# EAGLE schematic eg3301_pcb v3 (EAGLE 9.7.0)
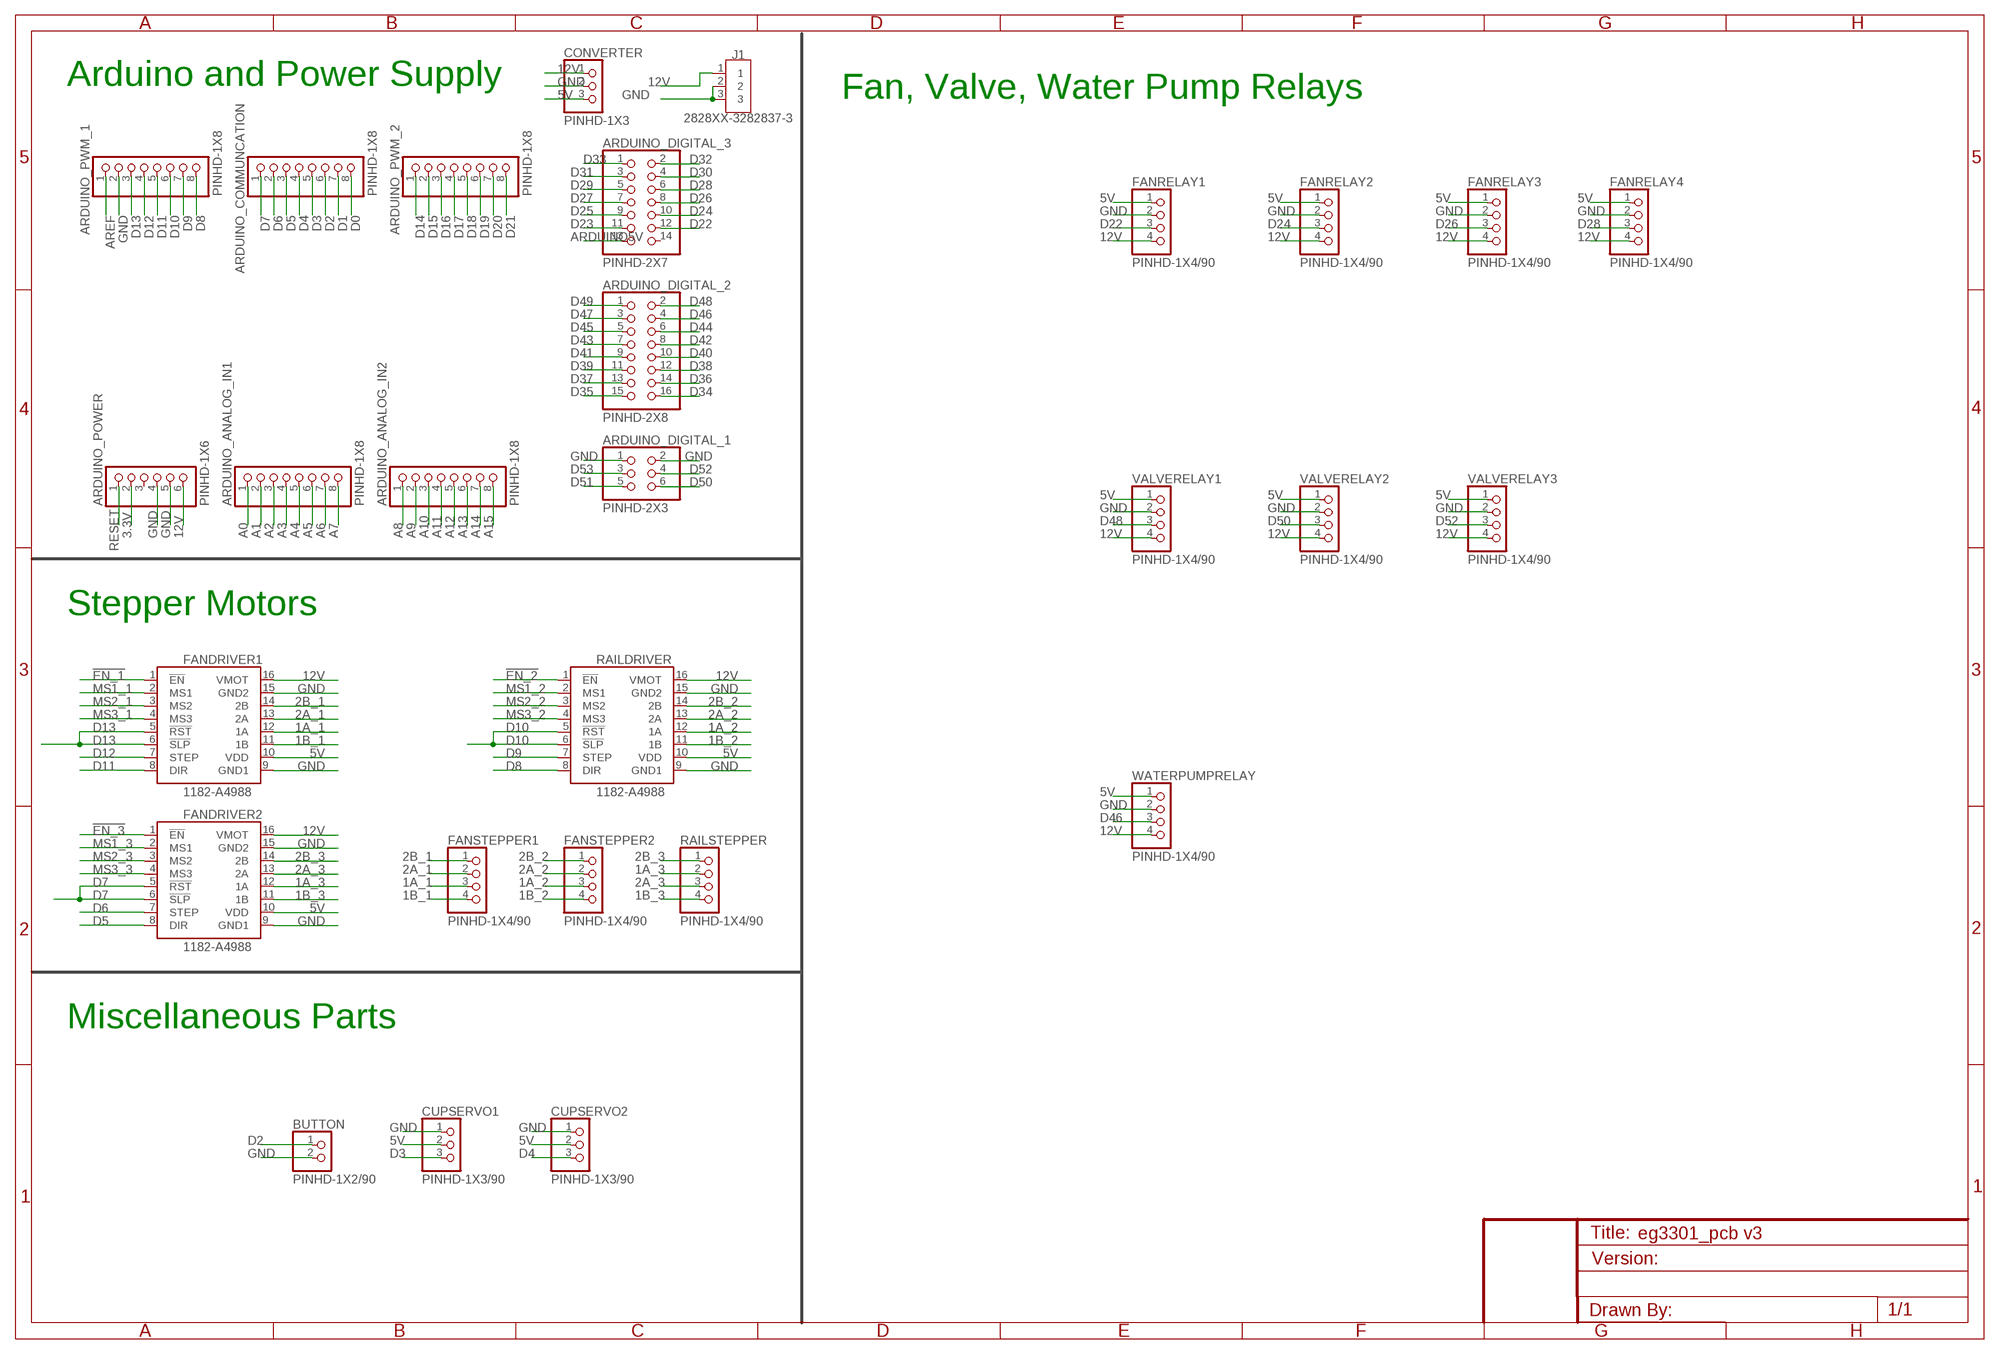
[diagram p0: schematic, sheet 1]

## Parts
ARDUINO_ANALOG_IN1  PINHD-1X8  [1X08]
ARDUINO_ANALOG_IN2  PINHD-1X8  [1X08]
ARDUINO_COMMUNCATION  PINHD-1X8  [1X08]
ARDUINO_DIGITAL_1  PINHD-2X3  [2X03]
ARDUINO_DIGITAL_2  PINHD-2X8  [2X08]
ARDUINO_DIGITAL_3  PINHD-2X7  [2X07]
ARDUINO_POWER  PINHD-1X6  [1X06]
ARDUINO_PWM_1  PINHD-1X8  [1X08]
ARDUINO_PWM_2  PINHD-1X8  [1X08]
BUTTON  PINHD-1X2/90  [1X02/90]
CONVERTER  PINHD-1X3  [1X03]
CUPSERVO1  PINHD-1X3/90  [1X03/90]
CUPSERVO2  PINHD-1X3/90  [1X03/90]
FANDRIVER1  1182-A4988  [A4988]
FANDRIVER2  1182-A4988  [A4988]
FANRELAY1  PINHD-1X4/90  [1X04/90]
FANRELAY2  PINHD-1X4/90  [1X04/90]
FANRELAY3  PINHD-1X4/90  [1X04/90]
FANRELAY4  PINHD-1X4/90  [1X04/90]
FANSTEPPER1  PINHD-1X4/90  [1X04/90]
FANSTEPPER2  PINHD-1X4/90  [1X04/90]
J1  2828XX-3282837-3  [TERMBLK_508-3N]
RAILDRIVER  1182-A4988  [A4988]
RAILSTEPPER  PINHD-1X4/90  [1X04/90]
VALVERELAY1  PINHD-1X4/90  [1X04/90]
VALVERELAY2  PINHD-1X4/90  [1X04/90]
VALVERELAY3  PINHD-1X4/90  [1X04/90]
WATERPUMPRELAY  PINHD-1X4/90  [1X04/90]

## Nets
1A_1: FANDRIVER1.12(1A) FANSTEPPER1.3
1A_2: FANSTEPPER2.3 RAILDRIVER.12(1A)
1A_3: FANDRIVER2.12(1A) RAILSTEPPER.2
1B_1: FANDRIVER1.11(1B) FANSTEPPER1.4
1B_2: FANSTEPPER2.4 RAILDRIVER.11(1B)
1B_3: FANDRIVER2.11(1B) RAILSTEPPER.4
2A_1: FANDRIVER1.13(2A) FANSTEPPER1.2
2A_2: FANSTEPPER2.2 RAILDRIVER.13(2A)
2A_3: FANDRIVER2.13(2A) RAILSTEPPER.3
2B_1: FANDRIVER1.14(2B) FANSTEPPER1.1
2B_2: FANSTEPPER2.1 RAILDRIVER.14(2B)
2B_3: FANDRIVER2.14(2B) RAILSTEPPER.1
3.3V: ARDUINO_POWER.2
5V: CONVERTER.3 CUPSERVO1.2 CUPSERVO2.2 FANDRIVER1.10(VDD) FANDRIVER2.10(VDD) FANRELAY1.1 FANRELAY2.1 FANRELAY3.1 FANRELAY4.1 RAILDRIVER.10(VDD) VALVERELAY1.1 VALVERELAY2.1 VALVERELAY3.1 WATERPUMPRELAY.1
12V: ARDUINO_POWER.6 CONVERTER.1 FANDRIVER1.16(VMOT) FANDRIVER2.16(VMOT) FANRELAY1.4 FANRELAY2.4 FANRELAY3.4 FANRELAY4.4 J1.1 RAILDRIVER.16(VMOT) VALVERELAY1.4 VALVERELAY2.4 VALVERELAY3.4 WATERPUMPRELAY.4
!EN_1: FANDRIVER1.1(!EN)
!EN_2: RAILDRIVER.1(!EN)
!EN_3: FANDRIVER2.1(!EN)
A0: ARDUINO_ANALOG_IN1.1
A1: ARDUINO_ANALOG_IN1.2
A2: ARDUINO_ANALOG_IN1.3
A3: ARDUINO_ANALOG_IN1.4
A4: ARDUINO_ANALOG_IN1.5
A5: ARDUINO_ANALOG_IN1.6
A6: ARDUINO_ANALOG_IN1.7
A7: ARDUINO_ANALOG_IN1.8
A8: ARDUINO_ANALOG_IN2.1
A9: ARDUINO_ANALOG_IN2.2
A10: ARDUINO_ANALOG_IN2.3
A11: ARDUINO_ANALOG_IN2.4
A12: ARDUINO_ANALOG_IN2.5
A13: ARDUINO_ANALOG_IN2.6
A14: ARDUINO_ANALOG_IN2.7
A15: ARDUINO_ANALOG_IN2.8
ARDUINO5V: ARDUINO_DIGITAL_3.13
AREF: ARDUINO_PWM_1.1
D0: ARDUINO_COMMUNCATION.8
D1: ARDUINO_COMMUNCATION.7
D2: ARDUINO_COMMUNCATION.6 BUTTON.1
D3: ARDUINO_COMMUNCATION.5 CUPSERVO1.3
D4: ARDUINO_COMMUNCATION.4 CUPSERVO2.3
D5: ARDUINO_COMMUNCATION.3 FANDRIVER2.8(DIR)
D6: ARDUINO_COMMUNCATION.2 FANDRIVER2.7(STEP)
D7: ARDUINO_COMMUNCATION.1 FANDRIVER2.5(!RST) FANDRIVER2.6(!SLP)
D8: ARDUINO_PWM_1.8 RAILDRIVER.8(DIR)
D9: ARDUINO_PWM_1.7 RAILDRIVER.7(STEP)
D10: ARDUINO_PWM_1.6 RAILDRIVER.5(!RST) RAILDRIVER.6(!SLP)
D11: ARDUINO_PWM_1.5 FANDRIVER1.8(DIR)
D12: ARDUINO_PWM_1.4 FANDRIVER1.7(STEP)
D13: ARDUINO_PWM_1.3 FANDRIVER1.5(!RST) FANDRIVER1.6(!SLP)
D14: ARDUINO_PWM_2.1
D15: ARDUINO_PWM_2.2
D16: ARDUINO_PWM_2.3
D17: ARDUINO_PWM_2.4
D18: ARDUINO_PWM_2.5
D19: ARDUINO_PWM_2.6
D20: ARDUINO_PWM_2.7
D21: ARDUINO_PWM_2.8
D22: ARDUINO_DIGITAL_3.12 FANRELAY1.3
D23: ARDUINO_DIGITAL_3.11
D24: ARDUINO_DIGITAL_3.10 FANRELAY2.3
D25: ARDUINO_DIGITAL_3.9
D26: ARDUINO_DIGITAL_3.8 FANRELAY3.3
D27: ARDUINO_DIGITAL_3.7
D28: ARDUINO_DIGITAL_3.6 FANRELAY4.3
D29: ARDUINO_DIGITAL_3.5
D30: ARDUINO_DIGITAL_3.4
D31: ARDUINO_DIGITAL_3.3
D32: ARDUINO_DIGITAL_3.2
D33: ARDUINO_DIGITAL_3.1
D34: ARDUINO_DIGITAL_2.16
D35: ARDUINO_DIGITAL_2.15
D36: ARDUINO_DIGITAL_2.14
D37: ARDUINO_DIGITAL_2.13
D38: ARDUINO_DIGITAL_2.12
D39: ARDUINO_DIGITAL_2.11
D40: ARDUINO_DIGITAL_2.10
D41: ARDUINO_DIGITAL_2.9
D42: ARDUINO_DIGITAL_2.8
D43: ARDUINO_DIGITAL_2.7
D44: ARDUINO_DIGITAL_2.6
D45: ARDUINO_DIGITAL_2.5
D46: ARDUINO_DIGITAL_2.4 WATERPUMPRELAY.3
D47: ARDUINO_DIGITAL_2.3
D48: ARDUINO_DIGITAL_2.2 VALVERELAY1.3
D49: ARDUINO_DIGITAL_2.1
D50: ARDUINO_DIGITAL_1.6 VALVERELAY2.3
D51: ARDUINO_DIGITAL_1.5
D52: ARDUINO_DIGITAL_1.4 VALVERELAY3.3
D53: ARDUINO_DIGITAL_1.3
GND: ARDUINO_DIGITAL_1.1 ARDUINO_DIGITAL_1.2 ARDUINO_POWER.4 ARDUINO_POWER.5 ARDUINO_PWM_1.2 BUTTON.2 CONVERTER.2 CUPSERVO1.1 CUPSERVO2.1 FANDRIVER1.9(GND1) FANDRIVER1.15(GND2) FANDRIVER2.9(GND1) FANDRIVER2.15(GND2) FANRELAY1.2 FANRELAY2.2 FANRELAY3.2 FANRELAY4.2 J1.2 J1.3 RAILDRIVER.9(GND1) RAILDRIVER.15(GND2) VALVERELAY1.2 VALVERELAY2.2 VALVERELAY3.2 WATERPUMPRELAY.2
MS1_1: FANDRIVER1.2(MS1)
MS1_2: RAILDRIVER.2(MS1)
MS1_3: FANDRIVER2.2(MS1)
MS2_1: FANDRIVER1.3(MS2)
MS2_2: RAILDRIVER.3(MS2)
MS2_3: FANDRIVER2.3(MS2)
MS3_1: FANDRIVER1.4(MS3)
MS3_2: RAILDRIVER.4(MS3)
MS3_3: FANDRIVER2.4(MS3)
RESET: ARDUINO_POWER.1
Unconnected: ARDUINO_DIGITAL_3.14 ARDUINO_POWER.3

## Notes on the sheet
- Arduino and Power Supply
- Fan, Valve, Water Pump Relays
- Stepper Motors
- Miscellaneous Parts

## Library data of the parts
ARDUINO_ANALOG_IN1 ARDUINO_ANALOG_IN2 ARDUINO_COMMUNCATION ARDUINO_PWM_1 ARDUINO_PWM_2 = Connector:PINHD-1X8: PIN HEADER; CATEGORY: Headers; DESCRIPTION: Header, Straight, 8 Position; MANUFACTURER: Generic; MPN: Generic; OPERATING_TEMPERATURE: Generic; PART_STATUS: Active; PITCH: 0.100" (2.54mm); ROHS_COMPLIANCE: Generic; SERIES: Generic; SUB-CATEGORY: Headers, Male Pins; TYPE: Board to Board or Cable, Unshrouded, Through Hole, Straight
ARDUINO_DIGITAL_1 = Connector:PINHD-2X3: PIN HEADER; CATEGORY: Headers; DESCRIPTION: Header, Straight, 2x3 Position; MANUFACTURER: Generic; MPN: Generic; OPERATING_TEMPERATURE: Generic; PART_STATUS: Active; PITCH: 0.100" (2.54mm); ROHS_COMPLIANCE: Generic; SERIES: Generic; SUB-CATEGORY: Headers, Male Pins; TYPE: Board to Board or Cable, Unshrouded, Through Hole, Straight
ARDUINO_DIGITAL_2 = Connector:PINHD-2X8: PIN HEADER; CATEGORY: Headers; DESCRIPTION: Header, Straight, 2x8 Position; MANUFACTURER: Generic; MPN: Generic; OPERATING_TEMPERATURE: Generic; PART_STATUS: Active; PITCH: 0.100" (2.54mm); ROHS_COMPLIANCE: Generic; SERIES: Generic; SUB-CATEGORY: Headers, Male Pins; TYPE: Board to Board or Cable, Unshrouded, Through Hole, Straight
ARDUINO_DIGITAL_3 = Connector:PINHD-2X7: PIN HEADER; CATEGORY: Headers; DESCRIPTION: Header, Straight, 2x7 Position; MANUFACTURER: Generic; MPN: Generic; OPERATING_TEMPERATURE: Generic; PART_STATUS: Active; PITCH: 0.100" (2.54mm); ROHS_COMPLIANCE: Generic; SERIES: Generic; SUB-CATEGORY: Headers, Male Pins; TYPE: Board to Board or Cable, Unshrouded, Through Hole, Straight
ARDUINO_POWER = Connector:PINHD-1X6: PIN HEADER; CATEGORY: Headers; DESCRIPTION: Header, Straight, 6 Position; MANUFACTURER: Generic; MPN: Generic; OPERATING_TEMPERATURE: Generic; PART_STATUS: Active; PITCH: 0.100" (2.54mm); ROHS_COMPLIANCE: Generic; SERIES: Generic; SUB-CATEGORY: Headers, Male Pins; TYPE: Board to Board or Cable, Unshrouded, Through Hole, Straight
BUTTON = Connector:PINHD-1X2: PIN HEADER; CATEGORY: Headers; DESCRIPTION: Header, Right Angle, 2 Position; MANUFACTURER: Generic; MPN: Generic; OPERATING_TEMPERATURE: Generic; PART_STATUS: Active; PITCH: 0.100" (2.54mm); ROHS_COMPLIANCE: Generic; SERIES: Generic; SUB-CATEGORY: Headers, Male Pins; TYPE: Board to Board or Cable, Unshrouded, Through Hole, Right Angle
CONVERTER = Connector:PINHD-1X3: PIN HEADER; CATEGORY: Headers; DESCRIPTION: Header, Straight, 3 Position; MANUFACTURER: Generic; MPN: Generic; OPERATING_TEMPERATURE: Generic; PART_STATUS: Active; PITCH: 0.100" (2.54mm); ROHS_COMPLIANCE: Generic; SERIES: Generic; SUB-CATEGORY: Headers, Male Pins; TYPE: Board to Board or Cable, Unshrouded, Through Hole, Straight
CUPSERVO1 CUPSERVO2 = Connector:PINHD-1X3: PIN HEADER; CATEGORY: Headers; DESCRIPTION: Header, Right Angle, 3 Position; MANUFACTURER: Generic; MPN: Generic; OPERATING_TEMPERATURE: Generic; PART_STATUS: Active; PITCH: 0.100" (2.54mm); ROHS_COMPLIANCE: Generic; SERIES: Generic; SUB-CATEGORY: Headers, Male Pins; TYPE: Board to Board or Cable, Unshrouded, Through Hole, Right Angle
FANDRIVER1 FANDRIVER2 RAILDRIVER = pololu-stepper-driver:1182-A4988: A4988 Stepper Motor Driver Carrier #1182 A4988 Stepper Motor Driver Carrier <https://www.pololu.com/product/1182> in Japan, Suzaku Lab. Ltd. <https://suzakugiken.jp/> #1182 A4988ステッピングモータドライバ <https://szc.jp/po1182>
FANRELAY1-FANRELAY4 FANSTEPPER1 FANSTEPPER2 RAILSTEPPER VALVERELAY1-VALVERELAY3 WATERPUMPRELAY = Connector:PINHD-1X4: PIN HEADER; CATEGORY: Headers; DESCRIPTION: Header, Right Angle, 4 Position; MANUFACTURER: Generic; MPN: Generic; OPERATING_TEMPERATURE: Generic; PART_STATUS: Active; PITCH: 0.100" (2.54mm); ROHS_COMPLIANCE: Generic; SERIES: Generic; SUB-CATEGORY: Headers, Male Pins; TYPE: Board to Board or Cable, Unshrouded, Through Hole, Right Angle
J1 = Connector:2828XX-3: 3 Position Wire to Board Terminal Block Horizontal with Board Datasheet <https://www.te.com.cn/commerce/DocumentDelivery/DDEController?Action=showdoc&DocId=Catalog+Section%7F1308389_EUROSTYLE_TERMINAL_BLOCKS%7F0607%7Fpdf%7FEnglish%7FENG_CS_1308389_EUROSTYLE_TERMINAL_BLOCKS_0607.pdf%7F2-282837-5>; CATEGORY: Connector; DESCRIPTION: TERM BLK 3P SIDE ENT 5.08mm PCB; MANUFACTURER: TE Connectivity; MPN: 282837-3; OPERATING_TEMPERATURE: -40°C to +105°C; PART_STATUS: Active; PITCH: 0.200" (5.08mm); ROHS_COMPLIANCE: RoHS Compliant; SERIES: Buchanan; SUBCATEGORY: Terminal Block; TYPE: Side Wire Entry